# Altium schematic sheet Sheet5.SchDoc
size A
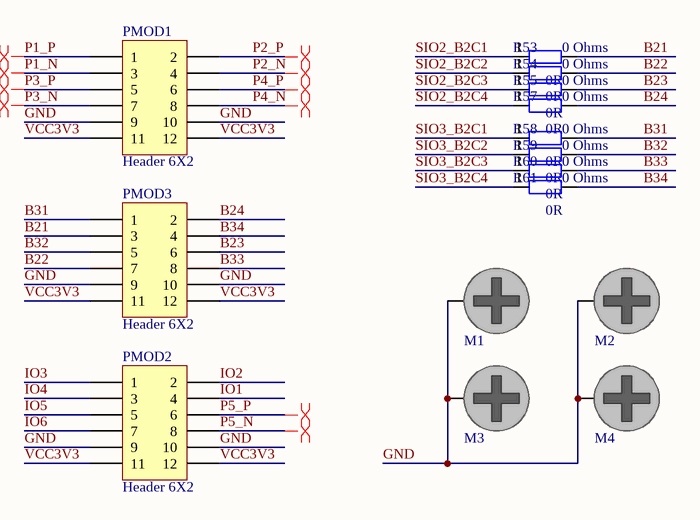
[diagram p0: Sheet5.SchDoc]

## Parts
M1  DNP/MH  [SCMH_M2]  (value not drawn)  (no BOM)
M2  DNP/MH  [SCMH_M2]  (value not drawn)  (no BOM)
M3  DNP/MH  [SCMH_M2]  (value not drawn)  (no BOM)
M4  DNP/MH  [SCMH_M2]  (value not drawn)  (no BOM)
PMOD1  Header 6X2  [HDR2X6]
PMOD2  Header 6X2  [HDR2X6]
PMOD3  Header 6X2  [HDR2X6]
R53  0 Ohms  value 0R  [RES0402i]
R54  0 Ohms  value 0R  [RES0402i]
R55  0 Ohms  value 0R  [RES0402i]
R57  0 Ohms  value 0R  [RES0402i]
R58  0 Ohms  value 0R  [RES0402i]
R59  0 Ohms  value 0R  [RES0402i]
R60  0 Ohms  value 0R  [RES0402i]
R61  0 Ohms  value 0R  [RES0402i]

## Nets
B21: PMOD3.3 R53.2
B22: PMOD3.7 R54.2
B23: PMOD3.6 R55.2
B24: PMOD3.2 R57.2
B31: PMOD3.1 R58.2
B32: PMOD3.5 R59.2
B33: PMOD3.8 R60.2
B34: PMOD3.4 R61.2
GND: M1.1 M2.1 M3.1 M4.1 PMOD1.9 PMOD1.10 PMOD2.9 PMOD2.10 PMOD3.9 PMOD3.10
IO1: PMOD2.4
IO2: PMOD2.2
IO3: PMOD2.1
IO4: PMOD2.3
IO5: PMOD2.5
IO6: PMOD2.7
P1_N: PMOD1.3
P1_P: PMOD1.1
P2_N: PMOD1.4
P2_P: PMOD1.2
P3_N: PMOD1.7
P3_P: PMOD1.5
P4_N: PMOD1.8
P4_P: PMOD1.6
P5_N: PMOD2.8
P5_P: PMOD2.6
SIO2_B2C1: R53.1
SIO2_B2C2: R54.1
SIO2_B2C3: R55.1
SIO2_B2C4: R57.1
SIO3_B2C1: R58.1
SIO3_B2C2: R59.1
SIO3_B2C3: R60.1
SIO3_B2C4: R61.1
VCC3V3: PMOD1.11 PMOD1.12 PMOD2.11 PMOD2.12 PMOD3.11 PMOD3.12

## Layout directives
differential pair: P1_N, P1_P, P2_N, P2_P, P3_N, P3_P, P4_N, P4_P, P5_N, P5_P

## Library data of the parts
M1-M4 = SCMH_M2: SCREW mouting, M2, 2.0mm diameter and 4.0mm PanHead; ASSEMBLY: DNP; VALUE: DNP/MH
PMOD1-PMOD3 = Header 6X2: Header, 6-Pin, Dual row; LatestRevisionDate: 17-Jul-2002; LatestRevisionNote: Re-released for DXP Platform.; Publisher: Altium Limited
R53-R55 R57-R61 = Res_0R_0402: 0402, 0R; Part Number: CRCW04020000Z0EDC; Manufacturer 1: Vishay; Voltage: 50V; Temperature Coefficient: 0 PPM / C; Package: 0402 (1005 Metric); Operating Temperature: -55°C ~ 125°C; Mounting Type: SMT; Applications: Commercial Grade; Supplier 1: Mouser; Supplier Part Number 1: 71-CRCW04020000Z0EDC; Manufacturer Part Number 1: CRCW04020000Z0EDC; Component Type: Generic; Resistance: 0 Ohms; Note: *; Supplier 2: DigiKey; Supplier 3: Farnell; Supplier Part Number 2: 541-4062-1-ND; Supplier Part Number 3: *